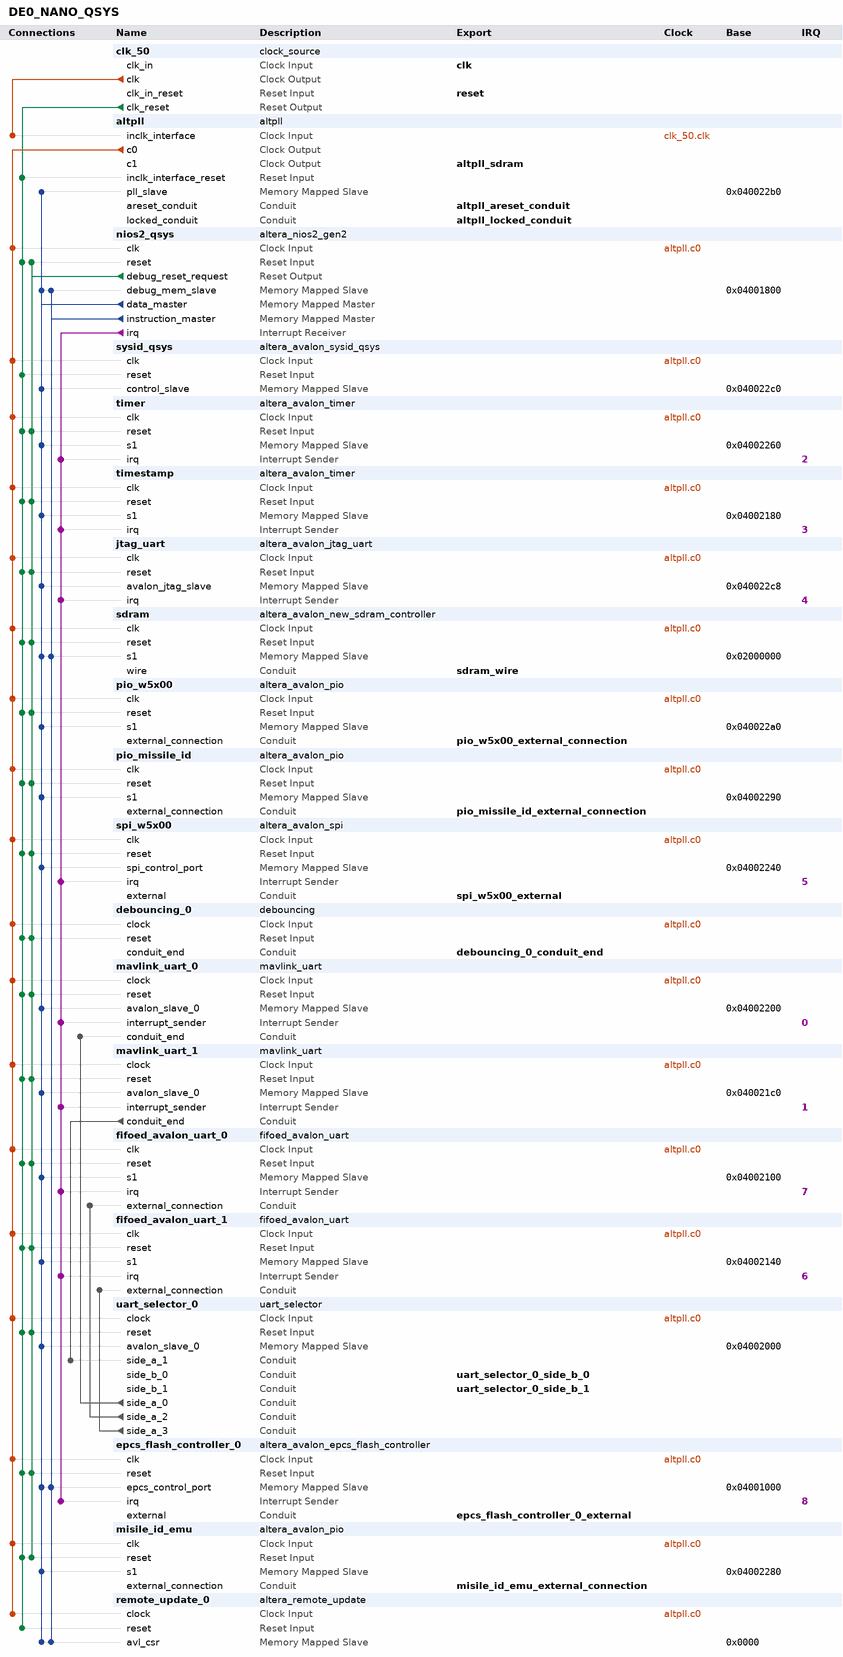
[diagram p0: system contents]
# Platform Designer (Qsys) system DE0_NANO_QSYS, Cyclone IV E EP4CE22F17C6
# Parameters at their usual value, and those the tool derives, are not listed.
package require -exact qsys 18.1
create_system DE0_NANO_QSYS
set_project_property DEVICE_FAMILY {Cyclone IV E}
set_project_property DEVICE EP4CE22F17C6

add_instance clk_50 clock_source 18.1
set_instance_parameter_value clk_50 clockFrequency 50000000

add_instance altpll altpll 18.1
set_instance_parameter_value altpll CLK0_DIVIDE_BY 1
set_instance_parameter_value altpll CLK0_MULTIPLY_BY 2
set_instance_parameter_value altpll CLK1_DIVIDE_BY 1
set_instance_parameter_value altpll CLK1_DUTY_CYCLE 50
set_instance_parameter_value altpll CLK1_MULTIPLY_BY 2
set_instance_parameter_value altpll CLK1_PHASE_SHIFT -1667
set_instance_parameter_value altpll INCLK0_INPUT_FREQUENCY 20000
set_instance_parameter_value altpll PORT_ARESET PORT_USED
set_instance_parameter_value altpll PORT_LOCKED PORT_USED
set_instance_parameter_value altpll PORT_clk1 PORT_USED
set_instance_parameter_value altpll PORT_clk2 PORT_UNUSED
set_instance_parameter_value altpll PORT_clk3 PORT_UNUSED

add_instance nios2_qsys altera_nios2_gen2 18.1
set_instance_parameter_value nios2_qsys dcache_size 2048
set_instance_parameter_value nios2_qsys exceptionSlave sdram.s1
set_instance_parameter_value nios2_qsys icache_size 4096
set_instance_parameter_value nios2_qsys impl Fast
set_instance_parameter_value nios2_qsys resetSlave epcs_flash_controller_0.epcs_control_port
set_instance_parameter_value nios2_qsys setting_activateTrace true
set_instance_parameter_value nios2_qsys setting_shadowRegisterSets 63

add_instance sysid_qsys altera_avalon_sysid_qsys 18.1
set_instance_parameter_value sysid_qsys id 0

add_instance timer altera_avalon_timer 18.1
set_instance_parameter_value timer period 1
set_instance_parameter_value timer periodUnits MSEC

add_instance timestamp altera_avalon_timer 18.1
set_instance_parameter_value timestamp counterSize 64
set_instance_parameter_value timestamp period 9223372036854775807
set_instance_parameter_value timestamp periodUnits CLOCKS

add_instance jtag_uart altera_avalon_jtag_uart 18.1
set_instance_parameter_value jtag_uart simInteractiveOptions NO_INTERACTIVE_WINDOWS

add_instance sdram altera_avalon_new_sdram_controller 18.1
set_instance_parameter_value sdram TAC 5.5
set_instance_parameter_value sdram TRCD 20.0
set_instance_parameter_value sdram TRP 20.0
set_instance_parameter_value sdram casLatency 3
set_instance_parameter_value sdram columnWidth 9
set_instance_parameter_value sdram dataWidth 16
set_instance_parameter_value sdram generateSimulationModel true
set_instance_parameter_value sdram model single_Micron_MT48LC4M32B2_7_chip
set_instance_parameter_value sdram numberOfBanks 4
set_instance_parameter_value sdram numberOfChipSelects 1
set_instance_parameter_value sdram powerUpDelay 100.0
set_instance_parameter_value sdram refreshPeriod 15.625
set_instance_parameter_value sdram rowWidth 13

add_instance pio_w5x00 altera_avalon_pio 18.1
set_instance_parameter_value pio_w5x00 direction Output
set_instance_parameter_value pio_w5x00 resetValue 3
set_instance_parameter_value pio_w5x00 width 8

add_instance pio_missile_id altera_avalon_pio 18.1
set_instance_parameter_value pio_missile_id direction Input
set_instance_parameter_value pio_missile_id width 16

add_instance spi_w5x00 altera_avalon_spi 18.1
set_instance_parameter_value spi_w5x00 clockPolarity 0
set_instance_parameter_value spi_w5x00 dataWidth 8
set_instance_parameter_value spi_w5x00 masterSPI true
set_instance_parameter_value spi_w5x00 numberOfSlaves 1
set_instance_parameter_value spi_w5x00 targetClockRate 5000000

add_instance debouncing_0 debouncing 1.0
set_instance_parameter_value debouncing_0 CORE_FREQUENCY 100000000
set_instance_parameter_value debouncing_0 DEBOUNCE_TIME 10
set_instance_parameter_value debouncing_0 DEFAULT_PORT_VAL 65535
set_instance_parameter_value debouncing_0 WIDTH 16

add_instance mavlink_uart_0 mavlink_uart 1.7
set_instance_parameter_value mavlink_uart_0 BAUDRATE 115200
set_instance_parameter_value mavlink_uart_0 CRC_EXTRA_ENABLE true
set_instance_parameter_value mavlink_uart_0 DATA_BIT 8
set_instance_parameter_value mavlink_uart_0 FREQ_CLK 100000000
set_instance_parameter_value mavlink_uart_0 HARDWARE_CLR_PARSE_EN true
set_instance_parameter_value mavlink_uart_0 INCLUDE_RX true
set_instance_parameter_value mavlink_uart_0 INCLUDE_TX true
set_instance_parameter_value mavlink_uart_0 PARITY_BIT 0
set_instance_parameter_value mavlink_uart_0 RX_FIFO_BIT_WIDTH 10
set_instance_parameter_value mavlink_uart_0 STOP_BIT 0
set_instance_parameter_value mavlink_uart_0 TX_FIFO_BIT_WIDTH 6

add_instance mavlink_uart_1 mavlink_uart 1.7
set_instance_parameter_value mavlink_uart_1 BAUDRATE 115200
set_instance_parameter_value mavlink_uart_1 CRC_EXTRA_ENABLE true
set_instance_parameter_value mavlink_uart_1 DATA_BIT 8
set_instance_parameter_value mavlink_uart_1 FREQ_CLK 100000000
set_instance_parameter_value mavlink_uart_1 HARDWARE_CLR_PARSE_EN true
set_instance_parameter_value mavlink_uart_1 INCLUDE_RX true
set_instance_parameter_value mavlink_uart_1 INCLUDE_TX true
set_instance_parameter_value mavlink_uart_1 PARITY_BIT 0
set_instance_parameter_value mavlink_uart_1 RX_FIFO_BIT_WIDTH 10
set_instance_parameter_value mavlink_uart_1 STOP_BIT 0
set_instance_parameter_value mavlink_uart_1 TX_FIFO_BIT_WIDTH 6

add_instance fifoed_avalon_uart_0 fifoed_avalon_uart 13.2
set_instance_parameter_value fifoed_avalon_uart_0 add_error_bits false
set_instance_parameter_value fifoed_avalon_uart_0 baud 115200
set_instance_parameter_value fifoed_avalon_uart_0 dataBits 8
set_instance_parameter_value fifoed_avalon_uart_0 driver_pass_error_bits false
set_instance_parameter_value fifoed_avalon_uart_0 export_handshake false
set_instance_parameter_value fifoed_avalon_uart_0 fifo_export_used false
set_instance_parameter_value fifoed_avalon_uart_0 fifo_size_rx 256
set_instance_parameter_value fifoed_avalon_uart_0 fifo_size_tx 16
set_instance_parameter_value fifoed_avalon_uart_0 fixedBaud true
set_instance_parameter_value fifoed_avalon_uart_0 gap_value 4
set_instance_parameter_value fifoed_avalon_uart_0 hw_cts false
set_instance_parameter_value fifoed_avalon_uart_0 parity NONE
set_instance_parameter_value fifoed_avalon_uart_0 rx_IRQ_Threshold 1
set_instance_parameter_value fifoed_avalon_uart_0 rx_fifo_LE false
set_instance_parameter_value fifoed_avalon_uart_0 simInteractiveInputEnable false
set_instance_parameter_value fifoed_avalon_uart_0 simInteractiveOutputEnable false
set_instance_parameter_value fifoed_avalon_uart_0 simTrueBaud false
set_instance_parameter_value fifoed_avalon_uart_0 stopBits 1
set_instance_parameter_value fifoed_avalon_uart_0 syncRegDepth 2
set_instance_parameter_value fifoed_avalon_uart_0 timeout_value 4
set_instance_parameter_value fifoed_avalon_uart_0 timestamp_width 8
set_instance_parameter_value fifoed_avalon_uart_0 trans_pin false
set_instance_parameter_value fifoed_avalon_uart_0 tx_IRQ_Threshold 1
set_instance_parameter_value fifoed_avalon_uart_0 tx_fifo_LE false
set_instance_parameter_value fifoed_avalon_uart_0 useCtsRts false
set_instance_parameter_value fifoed_avalon_uart_0 useEopRegister false
set_instance_parameter_value fifoed_avalon_uart_0 useRelativePathForSimFile false
set_instance_parameter_value fifoed_avalon_uart_0 use_ext_timestamp false
set_instance_parameter_value fifoed_avalon_uart_0 use_gap_detection false
set_instance_parameter_value fifoed_avalon_uart_0 use_rx_fifo true
set_instance_parameter_value fifoed_avalon_uart_0 use_status_bit_clear false
set_instance_parameter_value fifoed_avalon_uart_0 use_timestamp false
set_instance_parameter_value fifoed_avalon_uart_0 use_timout false
set_instance_parameter_value fifoed_avalon_uart_0 use_tx_fifo true

add_instance fifoed_avalon_uart_1 fifoed_avalon_uart 13.2
set_instance_parameter_value fifoed_avalon_uart_1 add_error_bits false
set_instance_parameter_value fifoed_avalon_uart_1 baud 115200
set_instance_parameter_value fifoed_avalon_uart_1 dataBits 8
set_instance_parameter_value fifoed_avalon_uart_1 driver_pass_error_bits false
set_instance_parameter_value fifoed_avalon_uart_1 export_handshake false
set_instance_parameter_value fifoed_avalon_uart_1 fifo_export_used false
set_instance_parameter_value fifoed_avalon_uart_1 fifo_size_rx 256
set_instance_parameter_value fifoed_avalon_uart_1 fifo_size_tx 16
set_instance_parameter_value fifoed_avalon_uart_1 fixedBaud true
set_instance_parameter_value fifoed_avalon_uart_1 gap_value 4
set_instance_parameter_value fifoed_avalon_uart_1 hw_cts false
set_instance_parameter_value fifoed_avalon_uart_1 parity NONE
set_instance_parameter_value fifoed_avalon_uart_1 rx_IRQ_Threshold 1
set_instance_parameter_value fifoed_avalon_uart_1 rx_fifo_LE false
set_instance_parameter_value fifoed_avalon_uart_1 simInteractiveInputEnable false
set_instance_parameter_value fifoed_avalon_uart_1 simInteractiveOutputEnable false
set_instance_parameter_value fifoed_avalon_uart_1 simTrueBaud false
set_instance_parameter_value fifoed_avalon_uart_1 stopBits 1
set_instance_parameter_value fifoed_avalon_uart_1 syncRegDepth 2
set_instance_parameter_value fifoed_avalon_uart_1 timeout_value 4
set_instance_parameter_value fifoed_avalon_uart_1 timestamp_width 8
set_instance_parameter_value fifoed_avalon_uart_1 trans_pin false
set_instance_parameter_value fifoed_avalon_uart_1 tx_IRQ_Threshold 1
set_instance_parameter_value fifoed_avalon_uart_1 tx_fifo_LE false
set_instance_parameter_value fifoed_avalon_uart_1 useCtsRts false
set_instance_parameter_value fifoed_avalon_uart_1 useEopRegister false
set_instance_parameter_value fifoed_avalon_uart_1 useRelativePathForSimFile false
set_instance_parameter_value fifoed_avalon_uart_1 use_ext_timestamp false
set_instance_parameter_value fifoed_avalon_uart_1 use_gap_detection false
set_instance_parameter_value fifoed_avalon_uart_1 use_rx_fifo true
set_instance_parameter_value fifoed_avalon_uart_1 use_status_bit_clear false
set_instance_parameter_value fifoed_avalon_uart_1 use_timestamp false
set_instance_parameter_value fifoed_avalon_uart_1 use_timout false
set_instance_parameter_value fifoed_avalon_uart_1 use_tx_fifo true

add_instance uart_selector_0 uart_selector 1.0

add_instance epcs_flash_controller_0 altera_avalon_epcs_flash_controller 18.1
set_instance_parameter_value epcs_flash_controller_0 resetrequest_enabled true

add_instance misile_id_emu altera_avalon_pio 18.1
set_instance_parameter_value misile_id_emu direction Output
set_instance_parameter_value misile_id_emu resetValue 65535
set_instance_parameter_value misile_id_emu width 16

add_instance remote_update_0 altera_remote_update 18.1
set_instance_parameter_value remote_update_0 CBX_AUTO_BLACKBOX ALL
set_instance_parameter_value remote_update_0 DEVICE EP4CE22F17C6
set_instance_parameter_value remote_update_0 GUI_config_device EPCS64
set_instance_parameter_value remote_update_0 check_app_pof false
set_instance_parameter_value remote_update_0 check_avalon_interface true
set_instance_parameter_value remote_update_0 m_support_write_config_check true
set_instance_parameter_value remote_update_0 operation_mode REMOTE

# connections
add_connection altpll.c0 debouncing_0.clock clock
add_connection altpll.c0 epcs_flash_controller_0.clk clock
add_connection altpll.c0 fifoed_avalon_uart_0.clk clock
add_connection altpll.c0 fifoed_avalon_uart_1.clk clock
add_connection altpll.c0 jtag_uart.clk clock
add_connection altpll.c0 mavlink_uart_0.clock clock
add_connection altpll.c0 mavlink_uart_1.clock clock
add_connection altpll.c0 misile_id_emu.clk clock
add_connection altpll.c0 nios2_qsys.clk clock
add_connection altpll.c0 pio_missile_id.clk clock
add_connection altpll.c0 pio_w5x00.clk clock
add_connection altpll.c0 remote_update_0.clock clock
add_connection altpll.c0 sdram.clk clock
add_connection altpll.c0 spi_w5x00.clk clock
add_connection altpll.c0 sysid_qsys.clk clock
add_connection altpll.c0 timer.clk clock
add_connection altpll.c0 timestamp.clk clock
add_connection altpll.c0 uart_selector_0.clock clock
add_connection clk_50.clk altpll.inclk_interface clock
add_connection clk_50.clk_reset altpll.inclk_interface_reset reset
add_connection clk_50.clk_reset debouncing_0.reset reset
add_connection clk_50.clk_reset epcs_flash_controller_0.reset reset
add_connection clk_50.clk_reset fifoed_avalon_uart_0.reset reset
add_connection clk_50.clk_reset fifoed_avalon_uart_1.reset reset
add_connection clk_50.clk_reset jtag_uart.reset reset
add_connection clk_50.clk_reset mavlink_uart_0.reset reset
add_connection clk_50.clk_reset mavlink_uart_1.reset reset
add_connection clk_50.clk_reset misile_id_emu.reset reset
add_connection clk_50.clk_reset nios2_qsys.reset reset
add_connection clk_50.clk_reset pio_missile_id.reset reset
add_connection clk_50.clk_reset pio_w5x00.reset reset
add_connection clk_50.clk_reset remote_update_0.reset reset
add_connection clk_50.clk_reset sdram.reset reset
add_connection clk_50.clk_reset spi_w5x00.reset reset
add_connection clk_50.clk_reset sysid_qsys.reset reset
add_connection clk_50.clk_reset timer.reset reset
add_connection clk_50.clk_reset timestamp.reset reset
add_connection clk_50.clk_reset uart_selector_0.reset reset
add_connection nios2_qsys.debug_reset_request debouncing_0.reset reset
add_connection nios2_qsys.debug_reset_request epcs_flash_controller_0.reset reset
add_connection nios2_qsys.debug_reset_request fifoed_avalon_uart_0.reset reset
add_connection nios2_qsys.debug_reset_request fifoed_avalon_uart_1.reset reset
add_connection nios2_qsys.debug_reset_request jtag_uart.reset reset
add_connection nios2_qsys.debug_reset_request mavlink_uart_0.reset reset
add_connection nios2_qsys.debug_reset_request mavlink_uart_1.reset reset
add_connection nios2_qsys.debug_reset_request misile_id_emu.reset reset
add_connection nios2_qsys.debug_reset_request nios2_qsys.reset reset
add_connection nios2_qsys.debug_reset_request pio_missile_id.reset reset
add_connection nios2_qsys.debug_reset_request pio_w5x00.reset reset
add_connection nios2_qsys.debug_reset_request sdram.reset reset
add_connection nios2_qsys.debug_reset_request spi_w5x00.reset reset
add_connection nios2_qsys.debug_reset_request timer.reset reset
add_connection nios2_qsys.debug_reset_request timestamp.reset reset
add_connection nios2_qsys.debug_reset_request uart_selector_0.reset reset
add_connection nios2_qsys.data_master altpll.pll_slave avalon
set_connection_parameter_value nios2_qsys.data_master/altpll.pll_slave baseAddress 0x040022b0
add_connection nios2_qsys.data_master epcs_flash_controller_0.epcs_control_port avalon
set_connection_parameter_value nios2_qsys.data_master/epcs_flash_controller_0.epcs_control_port baseAddress 0x04001000
add_connection nios2_qsys.data_master fifoed_avalon_uart_0.s1 avalon
set_connection_parameter_value nios2_qsys.data_master/fifoed_avalon_uart_0.s1 baseAddress 0x04002100
add_connection nios2_qsys.data_master fifoed_avalon_uart_1.s1 avalon
set_connection_parameter_value nios2_qsys.data_master/fifoed_avalon_uart_1.s1 baseAddress 0x04002140
add_connection nios2_qsys.data_master jtag_uart.avalon_jtag_slave avalon
set_connection_parameter_value nios2_qsys.data_master/jtag_uart.avalon_jtag_slave baseAddress 0x040022c8
add_connection nios2_qsys.data_master mavlink_uart_0.avalon_slave_0 avalon
set_connection_parameter_value nios2_qsys.data_master/mavlink_uart_0.avalon_slave_0 baseAddress 0x04002200
add_connection nios2_qsys.data_master mavlink_uart_1.avalon_slave_0 avalon
set_connection_parameter_value nios2_qsys.data_master/mavlink_uart_1.avalon_slave_0 baseAddress 0x040021c0
add_connection nios2_qsys.data_master misile_id_emu.s1 avalon
set_connection_parameter_value nios2_qsys.data_master/misile_id_emu.s1 baseAddress 0x04002280
add_connection nios2_qsys.data_master nios2_qsys.debug_mem_slave avalon
set_connection_parameter_value nios2_qsys.data_master/nios2_qsys.debug_mem_slave baseAddress 0x04001800
add_connection nios2_qsys.data_master pio_missile_id.s1 avalon
set_connection_parameter_value nios2_qsys.data_master/pio_missile_id.s1 baseAddress 0x04002290
add_connection nios2_qsys.data_master pio_w5x00.s1 avalon
set_connection_parameter_value nios2_qsys.data_master/pio_w5x00.s1 baseAddress 0x040022a0
add_connection nios2_qsys.data_master remote_update_0.avl_csr avalon
set_connection_parameter_value nios2_qsys.data_master/remote_update_0.avl_csr baseAddress 0x0000
add_connection nios2_qsys.data_master sdram.s1 avalon
set_connection_parameter_value nios2_qsys.data_master/sdram.s1 baseAddress 0x02000000
add_connection nios2_qsys.data_master spi_w5x00.spi_control_port avalon
set_connection_parameter_value nios2_qsys.data_master/spi_w5x00.spi_control_port baseAddress 0x04002240
add_connection nios2_qsys.data_master sysid_qsys.control_slave avalon
set_connection_parameter_value nios2_qsys.data_master/sysid_qsys.control_slave baseAddress 0x040022c0
add_connection nios2_qsys.data_master timer.s1 avalon
set_connection_parameter_value nios2_qsys.data_master/timer.s1 baseAddress 0x04002260
add_connection nios2_qsys.data_master timestamp.s1 avalon
set_connection_parameter_value nios2_qsys.data_master/timestamp.s1 baseAddress 0x04002180
add_connection nios2_qsys.data_master uart_selector_0.avalon_slave_0 avalon
set_connection_parameter_value nios2_qsys.data_master/uart_selector_0.avalon_slave_0 baseAddress 0x04002000
add_connection nios2_qsys.instruction_master epcs_flash_controller_0.epcs_control_port avalon
set_connection_parameter_value nios2_qsys.instruction_master/epcs_flash_controller_0.epcs_control_port baseAddress 0x04001000
add_connection nios2_qsys.instruction_master nios2_qsys.debug_mem_slave avalon
set_connection_parameter_value nios2_qsys.instruction_master/nios2_qsys.debug_mem_slave baseAddress 0x04001800
add_connection nios2_qsys.instruction_master remote_update_0.avl_csr avalon
set_connection_parameter_value nios2_qsys.instruction_master/remote_update_0.avl_csr baseAddress 0x0000
add_connection nios2_qsys.instruction_master sdram.s1 avalon
set_connection_parameter_value nios2_qsys.instruction_master/sdram.s1 baseAddress 0x02000000
add_connection mavlink_uart_1.conduit_end uart_selector_0.side_a_1 conduit
add_connection uart_selector_0.side_a_0 mavlink_uart_0.conduit_end conduit
add_connection uart_selector_0.side_a_2 fifoed_avalon_uart_0.external_connection conduit
add_connection uart_selector_0.side_a_3 fifoed_avalon_uart_1.external_connection conduit
add_connection nios2_qsys.irq epcs_flash_controller_0.irq interrupt
set_connection_parameter_value nios2_qsys.irq/epcs_flash_controller_0.irq irqNumber 8
add_connection nios2_qsys.irq fifoed_avalon_uart_0.irq interrupt
set_connection_parameter_value nios2_qsys.irq/fifoed_avalon_uart_0.irq irqNumber 7
add_connection nios2_qsys.irq fifoed_avalon_uart_1.irq interrupt
set_connection_parameter_value nios2_qsys.irq/fifoed_avalon_uart_1.irq irqNumber 6
add_connection nios2_qsys.irq jtag_uart.irq interrupt
set_connection_parameter_value nios2_qsys.irq/jtag_uart.irq irqNumber 4
add_connection nios2_qsys.irq mavlink_uart_0.interrupt_sender interrupt
set_connection_parameter_value nios2_qsys.irq/mavlink_uart_0.interrupt_sender irqNumber 0
add_connection nios2_qsys.irq mavlink_uart_1.interrupt_sender interrupt
set_connection_parameter_value nios2_qsys.irq/mavlink_uart_1.interrupt_sender irqNumber 1
add_connection nios2_qsys.irq spi_w5x00.irq interrupt
set_connection_parameter_value nios2_qsys.irq/spi_w5x00.irq irqNumber 5
add_connection nios2_qsys.irq timer.irq interrupt
set_connection_parameter_value nios2_qsys.irq/timer.irq irqNumber 2
add_connection nios2_qsys.irq timestamp.irq interrupt
set_connection_parameter_value nios2_qsys.irq/timestamp.irq irqNumber 3

# exported interfaces
add_interface altpll_areset_conduit conduit end
set_interface_property altpll_areset_conduit EXPORT_OF altpll.areset_conduit
add_interface altpll_locked_conduit conduit end
set_interface_property altpll_locked_conduit EXPORT_OF altpll.locked_conduit
add_interface altpll_sdram clock source
set_interface_property altpll_sdram EXPORT_OF altpll.c1
add_interface clk clock sink
set_interface_property clk EXPORT_OF clk_50.clk_in
add_interface debouncing_0_conduit_end conduit end
set_interface_property debouncing_0_conduit_end EXPORT_OF debouncing_0.conduit_end
add_interface epcs_flash_controller_0_external conduit end
set_interface_property epcs_flash_controller_0_external EXPORT_OF epcs_flash_controller_0.external
add_interface misile_id_emu_external_connection conduit end
set_interface_property misile_id_emu_external_connection EXPORT_OF misile_id_emu.external_connection
add_interface pio_missile_id_external_connection conduit end
set_interface_property pio_missile_id_external_connection EXPORT_OF pio_missile_id.external_connection
add_interface pio_w5x00_external_connection conduit end
set_interface_property pio_w5x00_external_connection EXPORT_OF pio_w5x00.external_connection
add_interface reset reset sink
set_interface_property reset EXPORT_OF clk_50.clk_in_reset
add_interface sdram_wire conduit end
set_interface_property sdram_wire EXPORT_OF sdram.wire
add_interface spi_w5x00_external conduit end
set_interface_property spi_w5x00_external EXPORT_OF spi_w5x00.external
add_interface uart_selector_0_side_b_0 conduit end
set_interface_property uart_selector_0_side_b_0 EXPORT_OF uart_selector_0.side_b_0
add_interface uart_selector_0_side_b_1 conduit end
set_interface_property uart_selector_0_side_b_1 EXPORT_OF uart_selector_0.side_b_1

set_interconnect_requirement {$system} qsys_mm.clockCrossingAdapter HANDSHAKE
set_interconnect_requirement {$system} qsys_mm.maxAdditionalLatency 1

save_system DE0_NANO_QSYS.qsys
